# Altium schematic sheet AltiumDesigner - Sheet_3.schdoc
size 194 x 64 mm
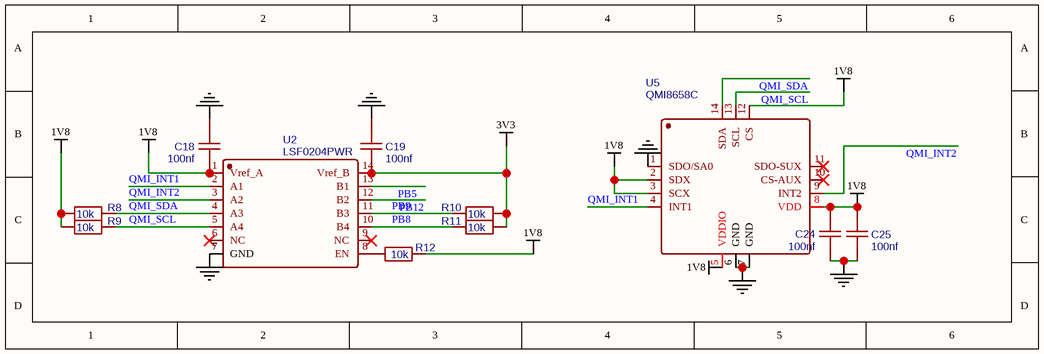
[diagram p0: AltiumDesigner - Sheet_3.schdoc]

## Parts
C18  100nf  [C0201]
C19  100nf  [C0201]
C24  100nf  [C0201]
C25  100nf  [C0201]
R8  10k  [R0201]
R9  10k  [R0201]
R10  10k  [R0201]
R11  10k  [R0201]
R12  10k  [R0201]
U2  LSF0204PWR  [TSSOP-14_L5.0-W4.4-P0.65-LS6.4-BL]
U5  QMI8658C  [LGA-14_L3.0-W2.5-P0.50-BR]

## Nets
1V8: C18.1 C24.1 C25.2 R8.1 R9.1 R12.1 U2.1(Vref_A) U5.2(SDX) U5.3(SCX) U5.5(VDDIO) U5.8(VDD) U5.12(CS)
3V3: C19.1 R10.2 R11.2 U2.14(Vref_B)
GND: C18.2 C19.2 C24.2 C25.1 U2.7(GND) U5.1(SDO/SA0) U5.6(GND) U5.7(GND)
PB5: U2.13(B1)
PB8: R11.1 U2.10(B4)
PB9: R10.1 U2.11(B3)
PB12: U2.12(B2)
QMI_INT1: U2.2(A1) U5.4(INT1)
QMI_INT2: U2.3(A2) U5.9(INT2)
QMI_SCL: R9.2 U2.5(A4) U5.13(SCL)
QMI_SDA: R8.2 U2.4(A3) U5.14(SDA)
NetR12_2: R12.2 U2.8(EN)

Not connected (* = marked no-connect by the designer): U2 6(NC)* 9(NC)*; U5 10(CS-AUX)* 11(SDO-SUX)*

## Library data of the parts
C18 C19 C24 C25 = 100nf: nameAlias: Value(F); Contributor: LCEDA_Lib; spicePre: C; spiceSymbolName: C_0201_US
R8-R12 = 10k: nameAlias: Value(Ω); Contributor: LCEDA_Lib; spicePre: R; spiceSymbolName: R_0201_EU
U2 = LSF0204PWR: BOM_Manufacturer: TI(德州仪器); Contributor: LCSC; BOM_Supplier: LCSC; BOM_Supplier Part: C202288; BOM_Manufacturer Part: LSF0204PWR; BOM_JLCPCB Part Class: Extended Part; spicePre: U; spiceSymbolName: LSF0204PWR
U5 = QMI8658C: BOM_Manufacturer: QST(上海矽睿); Contributor: LCSC; BOM_Supplier: LCSC; BOM_Supplier Part: C2842151; BOM_Manufacturer Part: QMI8658C; BOM_JLCPCB Part Class: Extended Part; spicePre: U; spiceSymbolName: QMI8658C